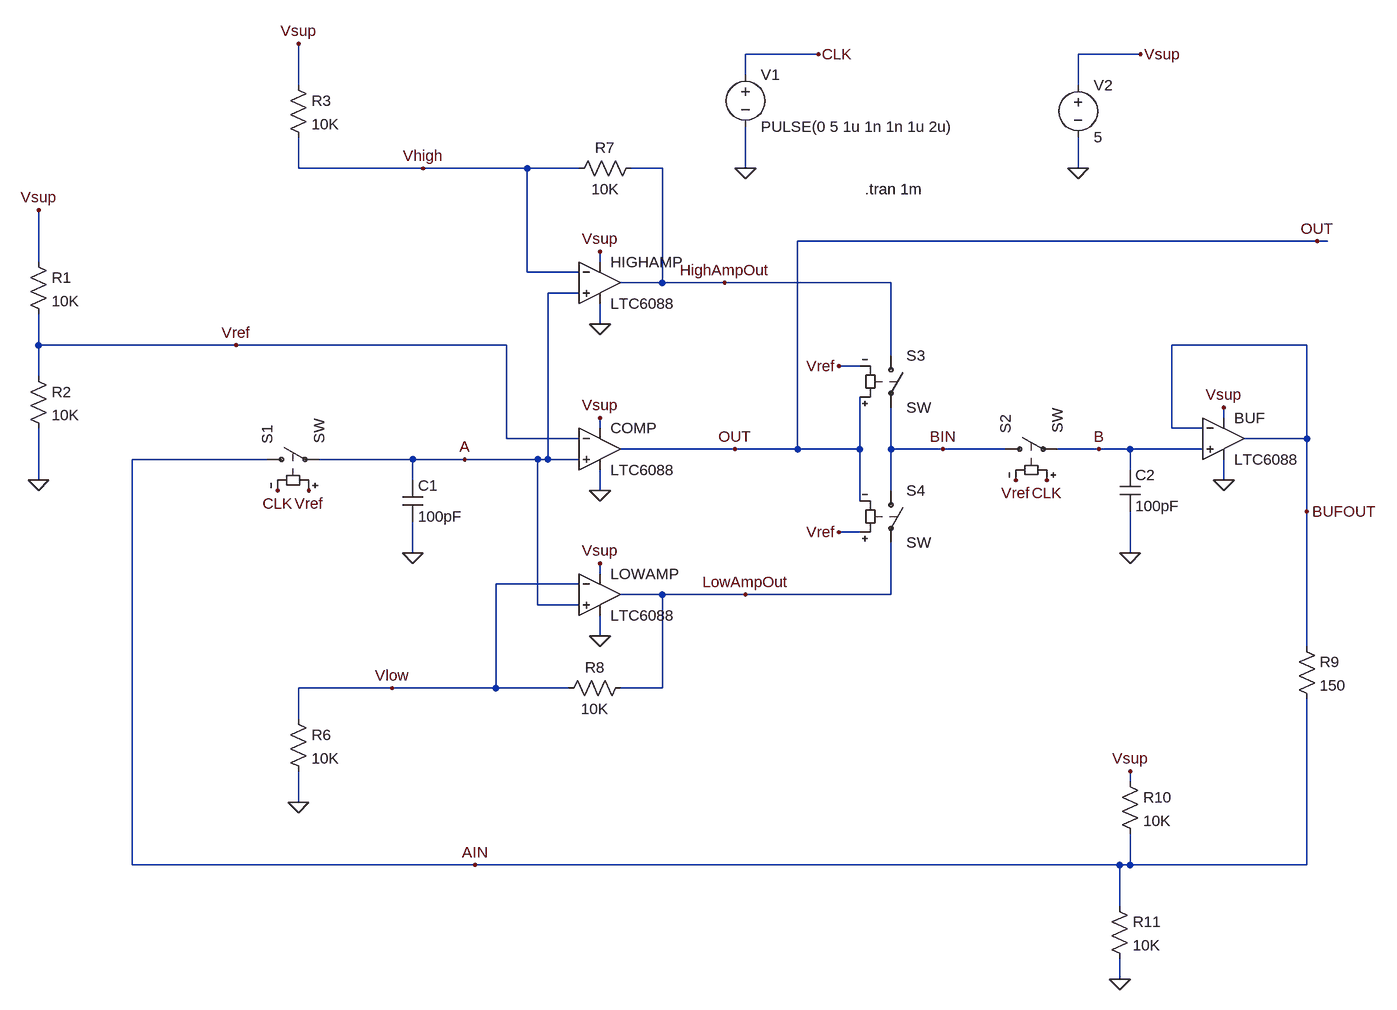
[diagram p0: schematic InfNoiseMult.asc]
InfNoiseMult.asc, the LTspice schematic file:
Version 4
SHEET 1 1396 1108
WIRE 560 -336 448 -336
WIRE 1056 -336 960 -336
WIRE 448 -304 448 -336
WIRE -240 -288 -240 -352
WIRE 960 -288 960 -336
WIRE -240 -160 -240 -208
WIRE -48 -160 -240 -160
WIRE 112 -160 -48 -160
WIRE 192 -160 112 -160
WIRE 320 -160 272 -160
WIRE 448 -160 448 -224
WIRE 960 -160 960 -208
WIRE 1328 -48 528 -48
WIRE 1344 -48 1328 -48
WIRE -640 -16 -640 -96
WIRE 224 -16 224 -32
WIRE 112 0 112 -160
WIRE 192 0 112 0
WIRE 320 16 320 -160
WIRE 320 16 256 16
WIRE 416 16 320 16
WIRE 672 16 416 16
WIRE 192 32 144 32
WIRE 224 80 224 48
WIRE -640 112 -640 64
WIRE -336 112 -640 112
WIRE 80 112 -336 112
WIRE 1312 112 1104 112
WIRE 672 128 672 16
WIRE 624 144 592 144
WIRE -640 160 -640 112
WIRE 1184 224 1184 208
WIRE 224 240 224 224
WIRE 1104 240 1104 112
WIRE 1152 240 1104 240
WIRE 80 256 80 112
WIRE 192 256 80 256
WIRE 1312 256 1312 112
WIRE 1312 256 1216 256
WIRE 432 272 256 272
WIRE 528 272 528 -48
WIRE 528 272 432 272
WIRE 624 272 624 192
WIRE 624 272 528 272
WIRE 672 272 672 208
WIRE 752 272 672 272
WIRE 848 272 752 272
WIRE 992 272 928 272
WIRE 1040 272 992 272
WIRE 1152 272 1040 272
WIRE -288 288 -496 288
WIRE -64 288 -208 288
WIRE 16 288 -64 288
WIRE 128 288 16 288
WIRE 144 288 144 32
WIRE 144 288 128 288
WIRE 192 288 144 288
WIRE 1040 304 1040 272
WIRE -640 320 -640 240
WIRE -64 320 -64 288
WIRE 1184 320 1184 288
WIRE 224 336 224 304
WIRE 672 336 672 272
WIRE 624 352 624 272
WIRE 1312 368 1312 256
WIRE 624 400 592 400
WIRE -64 432 -64 384
WIRE 1040 432 1040 368
WIRE 224 464 224 448
WIRE 192 480 64 480
WIRE 320 496 256 496
WIRE 448 496 320 496
WIRE 672 496 672 416
WIRE 672 496 448 496
WIRE 128 512 128 288
WIRE 192 512 128 512
WIRE 224 560 224 528
WIRE 1312 576 1312 368
WIRE -96 640 -240 640
WIRE 64 640 64 480
WIRE 64 640 -96 640
WIRE 176 640 64 640
WIRE 320 640 320 496
WIRE 320 640 256 640
WIRE -240 688 -240 640
WIRE 1040 784 1040 768
WIRE -240 816 -240 768
WIRE -496 912 -496 288
WIRE 32 912 -496 912
WIRE 1024 912 32 912
WIRE 1040 912 1040 864
WIRE 1040 912 1024 912
WIRE 1312 912 1312 656
WIRE 1312 912 1040 912
WIRE 1024 976 1024 912
WIRE 1024 1088 1024 1056
FLAG -640 320 0
FLAG -640 -96 Vsup
FLAG -64 432 0
FLAG -240 816 0
FLAG -240 -352 Vsup
FLAG 1040 432 0
FLAG 224 560 0
FLAG 224 336 0
FLAG 224 80 0
FLAG 1184 320 0
FLAG 224 -32 Vsup
FLAG 224 224 Vsup
FLAG 224 448 Vsup
FLAG 1184 208 Vsup
FLAG 592 144 Vref
FLAG 592 400 Vref
FLAG -272 336 CLK
FLAG 448 -160 0
FLAG 560 -336 CLK
FLAG -224 336 Vref
FLAG 864 320 Vref
FLAG 912 320 CLK
FLAG 960 -160 0
FLAG 1056 -336 Vsup
FLAG 1024 1088 0
FLAG 1040 768 Vsup
FLAG 16 288 A
FLAG 992 272 B
FLAG 1312 368 BUFOUT
FLAG 32 912 AIN
FLAG 752 272 BIN
FLAG 416 16 HighAmpOut
FLAG 448 496 LowAmpOut
FLAG 432 272 OUT
FLAG -48 -160 Vhigh
FLAG -96 640 Vlow
FLAG 1328 -48 OUT
FLAG -336 112 Vref
SYMBOL Opamps\\LTC6088 224 272 R0
SYMATTR InstName COMP
SYMBOL Opamps\\LTC6088 224 496 R0
SYMATTR InstName LOWAMP
SYMBOL Opamps\\LTC6088 224 16 R0
SYMATTR InstName HIGHAMP
SYMBOL Opamps\\LTC6088 1184 256 R0
SYMATTR InstName BUF
SYMBOL res -656 -32 R0
SYMATTR InstName R1
SYMATTR Value 10K
SYMBOL res -656 144 R0
SYMATTR InstName R2
SYMATTR Value 10K
SYMBOL sw -304 288 R270
SYMATTR InstName S1
SYMBOL sw 832 272 R270
SYMATTR InstName S2
SYMBOL sw 672 112 R0
SYMATTR InstName S3
SYMBOL sw 672 320 R0
SYMATTR InstName S4
SYMBOL cap -80 320 R0
SYMATTR InstName C1
SYMATTR Value 100pF
SYMBOL res -256 -304 R0
SYMATTR InstName R3
SYMATTR Value 10K
SYMBOL res -256 672 R0
SYMATTR InstName R6
SYMATTR Value 10K
SYMBOL cap 1024 304 R0
SYMATTR InstName C2
SYMATTR Value 100pF
SYMBOL voltage 448 -320 R0
WINDOW 123 0 0 Left 2
WINDOW 39 0 0 Left 2
SYMATTR InstName V1
SYMATTR Value PULSE(0 5 1u 1n 1n 1u 2u)
SYMBOL voltage 960 -304 R0
WINDOW 123 0 0 Left 2
WINDOW 39 0 0 Left 2
SYMATTR InstName V2
SYMATTR Value 5
SYMBOL res 176 -144 R270
WINDOW 0 32 56 VTop 2
WINDOW 3 0 56 VBottom 2
SYMATTR InstName R7
SYMATTR Value 10K
SYMBOL res 160 656 R270
WINDOW 0 32 56 VTop 2
WINDOW 3 0 56 VBottom 2
SYMATTR InstName R8
SYMATTR Value 10K
SYMBOL res 1296 560 R0
SYMATTR InstName R9
SYMATTR Value 150
SYMBOL res 1024 768 R0
SYMATTR InstName R10
SYMATTR Value 10K
SYMBOL res 1008 960 R0
SYMATTR InstName R11
SYMATTR Value 10K
TEXT 632 -128 Left 2 !.tran 1m

The netlist it stands for:
* InfNoiseMult.asc
* COMP: LTC6088 (symbol Opamps\LTC6088 not available, pins judged from their places): In+=A In-=Vref V+=Vsup V-=0 OUT=OUT
* LOWAMP: LTC6088 (symbol Opamps\LTC6088 not available, pins judged from their places): In+=A In-=Vlow V+=Vsup V-=0 OUT=LowAmpOut
* HIGHAMP: LTC6088 (symbol Opamps\LTC6088 not available, pins judged from their places): In+=A In-=Vhigh V+=Vsup V-=0 OUT=HighAmpOut
* BUF: LTC6088 (symbol Opamps\LTC6088 not available, pins judged from their places): In+=B In-=BUFOUT V+=Vsup V-=0 OUT=BUFOUT
R1 Vsup Vref 10K
R2 Vref 0 10K
S1 AIN A Vref CLK SW
S2 BIN B CLK Vref SW
S3 HighAmpOut BIN OUT Vref SW
S4 BIN LowAmpOut Vref OUT SW
C1 A 0 100pF
R3 Vsup Vhigh 10K
R6 Vlow 0 10K
C2 B 0 100pF
V1 CLK 0 PULSE(0 5 1u 1n 1n 1u 2u)
V2 Vsup 0 5
R7 Vhigh HighAmpOut 10K
R8 Vlow LowAmpOut 10K
R9 BUFOUT AIN 150
R10 Vsup AIN 10K
R11 AIN 0 10K
.tran 1m
.backanno
.end